# Altium schematic sheet MotherSheet.SchDoc
size A3; SheetNumber: 1; SheetTotal: 6
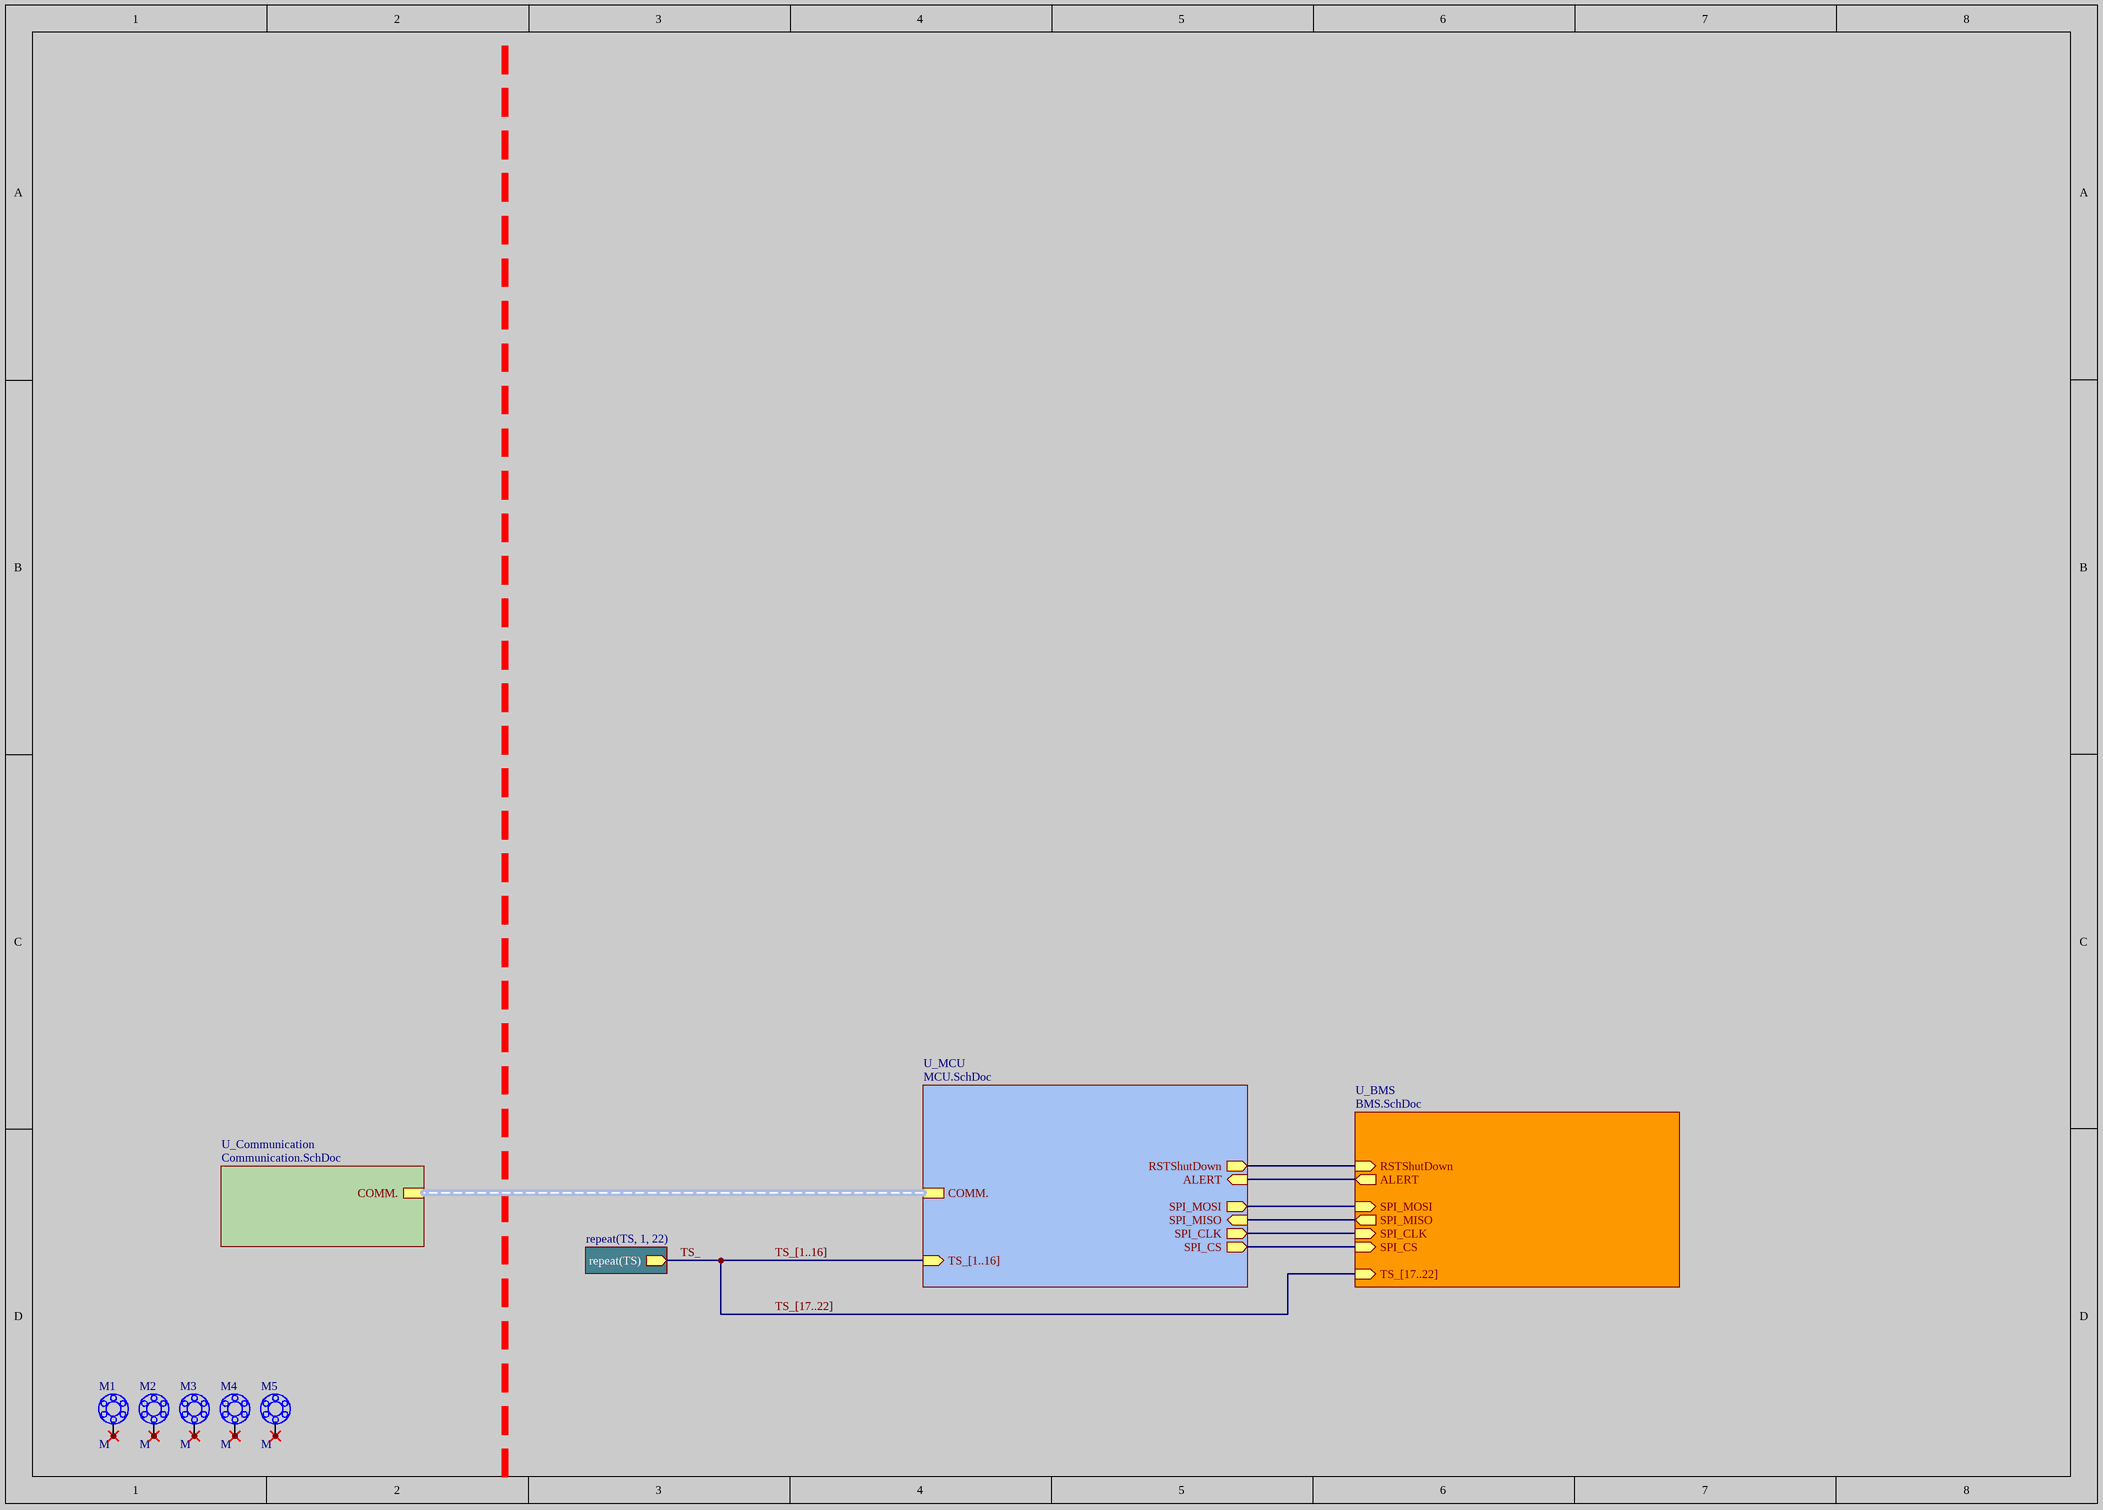
[diagram p0: MotherSheet.SchDoc]

## Parts
M1  M  [MOUNTING]  (no BOM)
M2  M  [MOUNTING]  (no BOM)
M3  M  [MOUNTING]  (no BOM)
M4  M  [MOUNTING]  (no BOM)
M5  M  [MOUNTING]  (no BOM)

## Sub-sheets
repeat(TS, 1, 22) = Temperature Sensors.SchDoc: repeat(TS) (out)
U_BMS = BMS.SchDoc: RSTShutDown (in), SPI_CS (in), SPI_MOSI (in), SPI_MISO (out), SPI_CLK (in), ALERT (out), TS_[17..22] (in)
U_Communication = Communication.SchDoc: COMM. (harness COMM.)
U_MCU = MCU.SchDoc: COMM. (harness COMM.), SPI_CS (out), SPI_MOSI (out), SPI_MISO (in), SPI_CLK (out), ALERT (in), RSTShutDown (out), TS_[1..16] (in)

## Nets
TS_: sheet repeat(TS, 1, 22)/repeat(TS)
NetM1_1: M1.1 M1.2 M1.3 M1.4 M1.5 M1.6 M1.7
NetM2_1: M2.1 M2.2 M2.3 M2.4 M2.5 M2.6 M2.7
NetM3_1: M3.1 M3.2 M3.3 M3.4 M3.5 M3.6 M3.7
NetM4_1: M4.1 M4.2 M4.3 M4.4 M4.5 M4.6 M4.7
NetM5_1: M5.1 M5.2 M5.3 M5.4 M5.5 M5.6 M5.7
(unnamed): sheet U_MCU/SPI_CS, sheet U_BMS/SPI_CS
(unnamed): sheet U_MCU/SPI_MOSI, sheet U_BMS/SPI_MOSI
(unnamed): sheet U_MCU/SPI_MISO, sheet U_BMS/SPI_MISO
(unnamed): sheet U_MCU/SPI_CLK, sheet U_BMS/SPI_CLK
(unnamed): sheet U_MCU/ALERT, sheet U_BMS/ALERT
(unnamed): sheet U_MCU/RSTShutDown, sheet U_BMS/RSTShutDown

## Buses and harness runs
bus TS_[1..16] = sheet U_MCU/TS_[1..16]
bus TS_[17..22] = sheet U_BMS/TS_[17..22]
harness sheet U_Communication/COMM. = sheet U_MCU/COMM.

## Library data of the parts
M1-M5 = MOUNTING